# Altium project Ethernet_Module.PrjPcb
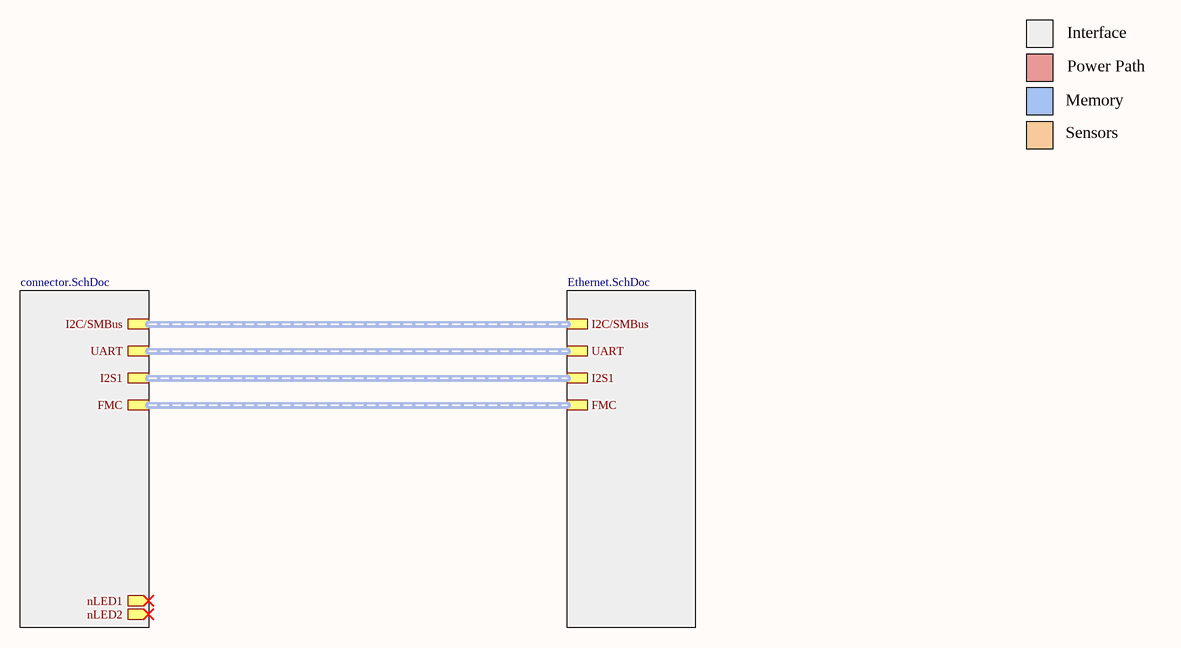
[diagram p0: main.SchDoc]
3 sheets, 39 parts. Net scope: hierarchical (ports join the sheet entries above them; power ports are global).
Board file: Ethernet_Module.PcbDoc
Sheets:
  main.SchDoc
    connector = connector.SchDoc
    peripheral = Ethernet.SchDoc

## Sheet main.SchDoc
size A4; SheetNumber: 1; SheetTotal: 3

### Sub-sheets
connector = connector.SchDoc: UART (harness UART), nLED1 (out), I2C/SMBus (harness I2C/SMBus), I2S1 (harness I2S1), nLED2 (out), FMC (harness FMC)
peripheral = Ethernet.SchDoc: I2C/SMBus, UART, I2S1, FMC

### Buses and harness runs
harness sheet connector/FMC = sheet peripheral/FMC
harness sheet connector/I2C/SMBus = sheet peripheral/I2C/SMBus
harness sheet connector/I2S1 = sheet peripheral/I2S1
harness sheet connector/UART = sheet peripheral/UART

### Notes on the sheet
- Interface
- Power Path
- Memory
- Sensors

## Sheet connector.SchDoc: Ethenet Module
size A3; CompanyName: ETH Zurich, University of Bologna; DrawnBy: Mattia Sinigaglia; Organization: IIS; DocumentNumber: 2; Revision: 0.1; SheetNumber: 3; SheetTotal: 3
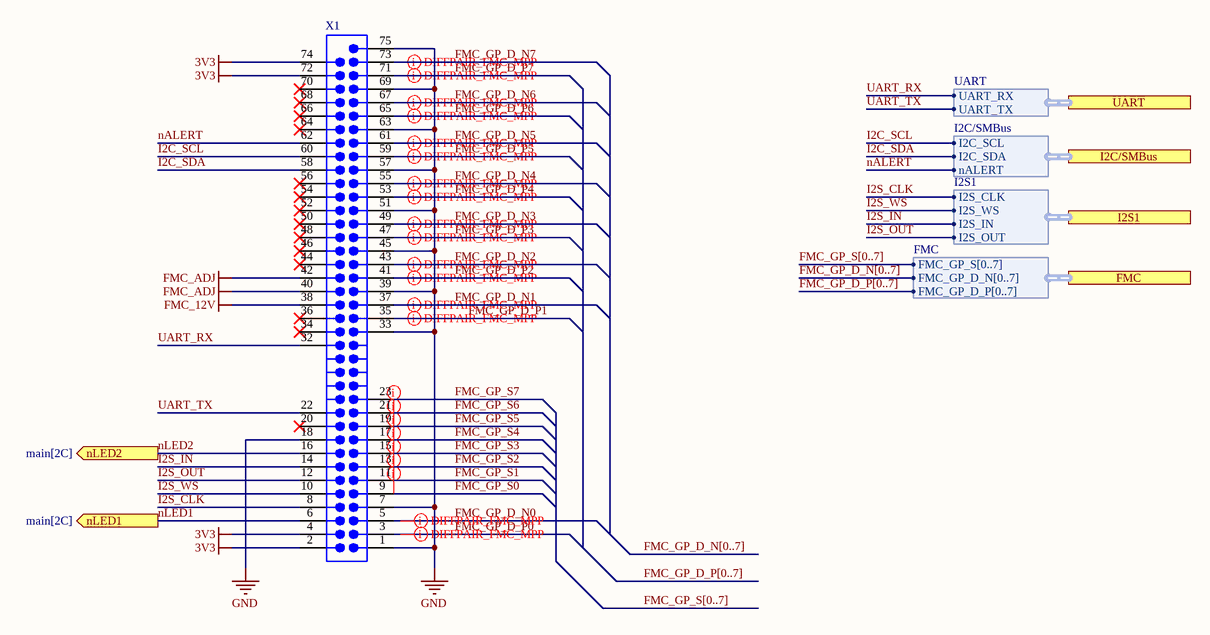
[diagram p1: connector.SchDoc]

### Parts
X1  CONN PWR CARD EDGE PCB SLOT MALE  [CON-67_0.5MM_PCB_SLOT]  (value not drawn)  (no BOM)

### Ports
FMC (harness FMC, see main[2B], Ethernet[2D]), I2C/SMBus (harness I2C/SMBus, see main[2B]), I2S1 (harness I2S1, see main[2B]), nLED1 (out, see main[2C]), nLED2 (out, see main[2C]), UART (harness UART, see main[2B])

### Harnesses
I2C/SMBus: I2C_SDA, I2C_SCL, nALERT
UART: UART_TX, UART_RX
I2S1: I2S_OUT, I2S_IN, I2S_WS, I2S_CLK
FMC: FMC_GP_D_N[0..7], FMC_GP_S[0..7], FMC_GP_D_P[0..7]

### Nets
3V3: X1.2 X1.4 X1.72 X1.74
FMC_12V: X1.38
FMC_ADJ: X1.40 X1.42
GND: X1.1 X1.7 X1.18 X1.33 X1.39 X1.45 X1.51 X1.57 X1.63 X1.69 X1.75
FMC_GP_D_N0: X1.5
FMC_GP_D_N1: X1.37
FMC_GP_D_N2: X1.43
FMC_GP_D_N3: X1.49
FMC_GP_D_N4: X1.55
FMC_GP_D_N5: X1.61
FMC_GP_D_N6: X1.67
FMC_GP_D_N7: X1.73
FMC_GP_D_P0: X1.3
FMC_GP_D_P1: X1.35
FMC_GP_D_P2: X1.41
FMC_GP_D_P3: X1.47
FMC_GP_D_P4: X1.53
FMC_GP_D_P5: X1.59
FMC_GP_D_P6: X1.65
FMC_GP_D_P7: X1.71
FMC_GP_S0: X1.9
FMC_GP_S1: X1.11
FMC_GP_S2: X1.13
FMC_GP_S3: X1.15
FMC_GP_S4: X1.17
FMC_GP_S5: X1.19
FMC_GP_S6: X1.21
FMC_GP_S7: X1.23
I2C_SCL: X1.60 ; port I2C/SMBus.I2C_SCL
I2C_SDA: X1.58 ; port I2C/SMBus.I2C_SDA
I2S_CLK: X1.8 ; port I2S1.I2S_CLK
I2S_IN: X1.14 ; port I2S1.I2S_IN
I2S_OUT: X1.12 ; port I2S1.I2S_OUT
I2S_WS: X1.10 ; port I2S1.I2S_WS
nALERT: X1.62 ; port I2C/SMBus.nALERT
nLED1: X1.6 ; port nLED1
nLED2: X1.16 ; port nLED2
UART_RX: X1.32 ; port UART.UART_RX
UART_TX: X1.22 ; port UART.UART_TX

Not connected (* = marked no-connect by the designer): X1 20* 34* 36* 44* 46* 48* 50* 52(51)* 54(52)* 56(53)* 64* 66* 68* 70*

### Buses and harness runs
bus FMC_GP_D_N[0..7]
bus FMC_GP_D_P[0..7]
bus FMC_GP_S[0..7]

### Layout directives
differential pair; net class DP_GP; differential pair class DP_100R: FMC_GP_D_N0, FMC_GP_D_N1, FMC_GP_D_N2, FMC_GP_D_N3, FMC_GP_D_N4, FMC_GP_D_N5, FMC_GP_D_N6, FMC_GP_D_N7, FMC_GP_D_P0, FMC_GP_D_P1, FMC_GP_D_P2, FMC_GP_D_P3, FMC_GP_D_P4, FMC_GP_D_P5, FMC_GP_D_P6, FMC_GP_D_P7
net class S_GP; net class SE_50R: FMC_GP_S0, FMC_GP_S1, FMC_GP_S2, FMC_GP_S3, FMC_GP_S4, FMC_GP_S5, FMC_GP_S6

### Notes on the sheet
- 1
- 2
- 3
- 4
- 5
- 6
- 7
- 8
- A
- B
- C
- D
- Project:
- Date:
- Drawing number:
- Rev:
- Format:
- A3
- Drawn by:
- Laboratory:
- Page
- Sheet:
- of
- File:

### Library data of the parts
X1 = CMP-01224-1: Mates with 2199119-4 - No BOM; Number of Positions: 67; Pitch: 0.5mm; Card Thickness: 0.8mm; Card Type: Non Specified - Dual Edge; Gender: Male; Mates with: 2199119-4

## Sheet Ethernet.SchDoc: Ethernet Module
size A3; Date: 16/04/2024; Author: Mattia Sinigaglia; CompanyName: ETH Zurich, University of Bologna; DrawnBy: Mattia Sinigaglia; Organization: IIS; DocumentNumber: 1; Revision: 0.1; SheetNumber: 3; SheetTotal: 3; SPICEModelCacheWVXKUZYT: <root> / <DocumentId>WVXKUZYT</DocumentId> / </root>; Project: Ethernet Module
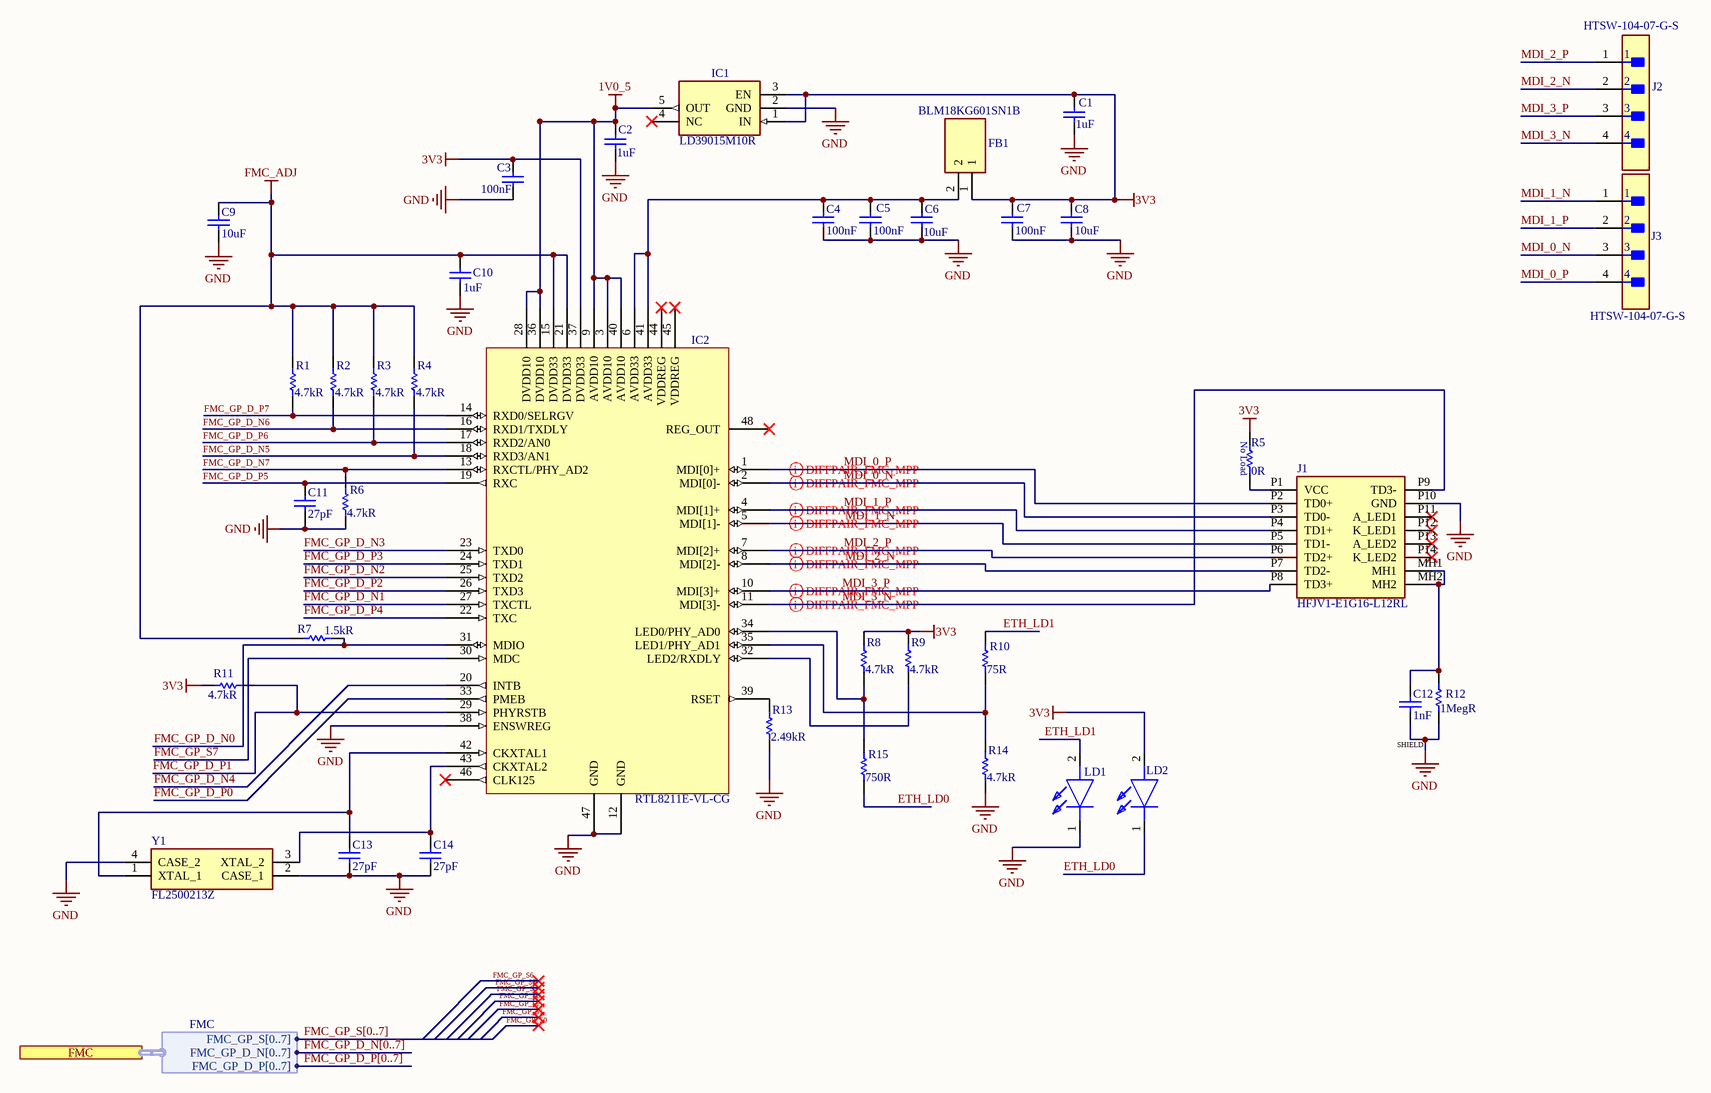
[diagram p2: Ethernet.SchDoc]

### Parts
C1  1uF  [CAPC1005X60X30LL05T10]
C2  1uF  [CAPC1005X60X30LL05T10]
C3  100nF  [CAPC1050X55X23LL05T13]
C4  100nF  [CAPC1050X55X23LL05T13]
C5  100nF  [CAPC1050X55X23LL05T13]
C6  10uF  [CAPC1608X90X35LL15T15]
C7  100nF  [CAPC1050X55X23LL05T13]
C8  10uF  [CAPC1608X90X35LL15T15]
C9  10uF  [CAPC1608X90X35LL15T15]
C10  1uF  [CAPC1005X60X30LL05T10]
C11  27pF  [CAPC1005X56X25LL10T15]
C12  1nF  [CAPC0603(1608)100_L]
C13  27pF  [CAPC1005X56X25LL10T15]
C14  27pF  [CAPC1005X56X25LL10T15]
FB1  BLM18KG601SN1B  [BLM18EG121SH1D]
IC1  LD39015M10R  [SOT95P280X145-5N]
IC2  RTL8211E-VL-CG  [QFN40P600X600X100-49N]
J1  HFJV1-E1G16-L12RL  [HFJV1E1G16L12RL]
J2  HTSW-104-07-G-S  [FP-HTSW-104-07-G-S-MFG]
J3  HTSW-104-07-G-S  [FP-HTSW-104-07-G-S-MFG]
LD1  AA3021LSYSK_J3-TR  [AA3021LSYSKJ3TR]  (value not drawn)
LD2  CSL1901VW1  [LEDC1608X65N]  (value not drawn)
R1  4.7kR  [RESC0603X28X15LL05T05]
R2  4.7kR  [RESC0603X28X15LL05T05]
R3  4.7kR  [RESC0603X28X15LL05T05]
R4  4.7kR  [RESC0603X28X15LL05T05]
R5  0R  [RESC1005X40X25LL05T05]
R6  4.7kR  [RESC0603X28X15LL05T05]
R7  1.5kR  [RESC0603X28N]
R8  4.7kR  [RESC0603X28X15LL05T05]
R9  4.7kR  [RESC0603X28X15LL05T05]
R10  75R  [RESC0603X28X15LL05T05]
R11  4.7kR  [RESC0603X28X15LL05T05]
R12  1MegR  [RESC0603X28X15LL05T05]
R13  2.49kR  [RESC0603X28X15LL05T05]
R14  4.7kR  [RESC0603X28X15LL05T05]
R15  750R  [RESC0603X28X15LL05T05]
Y1  FL2500213Z  [FL2500213Z]

### Ports
FMC (harness FMC, see main[3B], connector[6B])

### Harnesses
FMC: FMC_GP_D_N[0..7], FMC_GP_S[0..7], FMC_GP_D_P[0..7]

### Nets
1V0_5: C2.2 IC1.5(OUT) IC2.3(AVDD10) IC2.9(AVDD10) IC2.28(DVDD10) IC2.36(DVDD10) IC2.40(AVDD10)
3V3: C1.2 C3.2 C7.2 C8.2 FB1.1 IC1.1(IN) IC1.3(EN) IC2.37(DVDD33) LD2.2(A) R5.2 R8.2 R9.2 R11.2
FMC_ADJ: C9.2 C10.2 IC2.15(DVDD33) IC2.21(DVDD33) R1.2 R2.2 R3.2 R4.2 R7.1
GND: C1.1 C2.1 C3.1 C4.1 C5.1 C6.1 C7.1 C8.1 C9.1 C10.1 C11.1 C12.1 C13.1 C14.1 IC1.2(GND) IC2.12(GND) IC2.38(ENSWREG) IC2.47(GND) J1.P10(GND) LD1.1(K) R6.1 R12.1 R13.1 R14.1 Y1.2(CASE_1) Y1.4(CASE_2)
ETH_LD0: LD2.1(K) R15.1
ETH_LD1: LD1.2(A) R10.2
FMC_GP_D_N0: IC2.31(MDIO) R7.2
FMC_GP_D_N1: IC2.27(TXCTL)
FMC_GP_D_N2: IC2.25(TXD2)
FMC_GP_D_N3: IC2.23(TXD0)
FMC_GP_D_N4: IC2.20(INTB)
FMC_GP_D_N5: IC2.18(RXD3/AN1) R4.1
FMC_GP_D_N6: IC2.16(RXD1/TXDLY) R2.1
FMC_GP_D_N7: IC2.13(RXCTL/PHY_AD2) R6.2
FMC_GP_D_P0: IC2.33(PMEB)
FMC_GP_D_P1: IC2.29(PHYRSTB) R11.1
FMC_GP_D_P2: IC2.26(TXD3)
FMC_GP_D_P3: IC2.24(TXD1)
FMC_GP_D_P4: IC2.22(TXC)
FMC_GP_D_P5: C11.2 IC2.19(RXC)
FMC_GP_D_P6: IC2.17(RXD2/AN0) R3.1
FMC_GP_D_P7: IC2.14(RXD0/SELRGV) R1.1
FMC_GP_S7: IC2.30(MDC)
MDI_0_N: IC2.2(MDI[0]-) J1.P3(TD0-) J3.3
MDI_0_P: IC2.1(MDI[0]+) J1.P2(TD0+) J3.4
MDI_1_N: IC2.5(MDI[1]-) J1.P5(TD1-) J3.1
MDI_1_P: IC2.4(MDI[1]+) J1.P4(TD1+) J3.2
MDI_2_N: IC2.8(MDI[2]-) J1.P7(TD2-) J2.2
MDI_2_P: IC2.7(MDI[2]+) J1.P6(TD2+) J2.1
MDI_3_N: IC2.11(MDI[3]-) J1.P9(TD3-) J2.4
MDI_3_P: IC2.10(MDI[3]+) J1.P8(TD3+) J2.3
NetC4_2: C4.2 C5.2 C6.2 FB1.2 IC2.6(AVDD33) IC2.41(AVDD33)
NetC12_2: C12.2 J1.MH1 J1.MH2 R12.2
NetC13_2: C13.2 IC2.42(CKXTAL1) Y1.1(XTAL_1)
NetC14_2: C14.2 IC2.43(CKXTAL2) Y1.3(XTAL_2)
NetIC2_32: IC2.32(LED2/RXDLY) R9.1
NetIC2_34: IC2.34(LED0/PHY_AD0) R8.1 R15.2
NetIC2_35: IC2.35(LED1/PHY_AD1) R10.1 R14.2
NetIC2_39: IC2.39(RSET) R13.2
NetJ1_P1: J1.P1(VCC) R5.1

Not connected (* = marked no-connect by the designer): IC1 4(NC)*; IC2 44(VDDREG)* 45(VDDREG)* 46(CLK125)* 48(REG_OUT)*; J1 P11(A_LED1)* P12(K_LED1)* P13(A_LED2)* P14(K_LED2)*

### Buses and harness runs
bus FMC_GP_D_N[0..7]
bus FMC_GP_D_P[0..7]
bus FMC_GP_S[0..7]

### Layout directives
differential pair; net class DP_GP; differential pair class DP_100R: MDI_0_N, MDI_0_P, MDI_1_N, MDI_1_P, MDI_2_N, MDI_2_P, MDI_3_N, MDI_3_P

### Notes on the sheet
- (near R5) No Load
- SHIELD
- 1
- 2
- 3
- 4
- 5
- 6
- 7
- 8
- A
- B
- C
- D
- Project:
- Date:
- Drawing number:
- Rev:
- Format:
- A3
- Drawn by:
- Laboratory:
- Page
- Sheet:
- of
- File:

### Library data of the parts
C1 C2 C10 = CMP-2008-02044-1: Part Number: C0402C105K9PACTU; Manufacturer: Kemet; Dielectric Material: Ceramic; Tolerance: 10%; Voltage Rating: 6.3V; Dielectric: X5R; Supplier 1: Digi-Key; Supplier Part Number 1: 399-4873-6-ND; Manufacturer Part Number: C0402C105K9PACTU; RoHS: Yes; Category: Ceramic Capacitors; Stock 1: 1737568; Pricing 1: 1=0.10000, 10=0.02600, 100=0.01180, 500=0.00844, 1000=0.00662, 2500=0.00602, 5000=0.00554 (USD); Mount: Surface Mount; Case/Package: 0402; Number of Pins: 2; Case Code (Imperial): 0402; Min Operating Temperature: -55°C; Max Operating Temperature: 85°C; Value: 1uF; Packaging: Tape and Reel; Voltage Rating (DC): 6.3V; Package Quantity: 1; Termination: SMD/SMT; Voltage: 6.3V; Length: 1mm; Height: 0.5mm; Width: 0.02inch; Thickness: 0.022inch; Depth: 0.5mm; Lead Pitch: 0.3mm; Radiation Hardening: No; Lead Free: Lead Free; REACH SVHC: No SVHC; ComponentLink1URL: https://datasheet.ciiva.com/28645/1789732-28645392.pdf?src-supplier=Element14; ComponentLink1Description: https://datasheet.ciiva.com/28645/1789732-28645392.pdf?src-supplier=Element14; ComponentLink2URL: https://datasheet.ciiva.com/11786/0900766b8116eb59-11786028.pdf?src-supplier=RSComponents; ComponentLink2Description: https://datasheet.ciiva.com/11786/0900766b8116eb59-11786028.pdf?src-supplier=RSComponents; ComponentLink3URL: https://datasheet.ciiva.com/7747/kem-c1006-x5r-smd-7747445.pdf?src-supplier=Element14; ComponentLink3Description: https://datasheet.ciiva.com/7747/kem-c1006-x5r-smd-7747445.pdf?src-supplier=Element14; ComponentLink4URL: https://datasheet.ciiva.com/7747/40889-7747623.pdf?src-supplier=Element14; ComponentLink4Description: https://datasheet.ciiva.com/7747/40889-7747623.pdf?src-supplier=Element14; ComponentLink5URL: https://datasheet.ciiva.com/18192/getdatasheetpartid-127800-18192427.pdf?src-supplier=Verical; ComponentLink5Description: https://datasheet.ciiva.com/18192/getdatasheetpartid-127800-18192427.pdf?src-supplier=Verical
C3-C5 C7 = CMP-2000-05439-1: Chip Capacitor, 100 nF, +/- 10%, 16 V, -55 to 125 degC, 0402 (1005 Metric), RoHS, Tape and Reel; Manufacturer: Samsung Electro-Mechanics; Manufacturer Part Number: CL05B104KO5NNNC; Dielectric: X7R; Rated Voltage: 16V; Material: Ceramic; Case Size/Dimension: 0402; Tolerance (%): ±10%; Value: 100nF; Manufacturer URL: http://www.samsungsem.com/global/index.jsp; Datasheet URL: https://datasheet.ciiva.com/29198/458718-da-01-en-vs-kondensator-0402-29198423.pdf; Datasheet Version: Nov-10; Supplier 1: Digi-Key; Supplier Part Number 1: 1276-1001-1-ND; RoHS: Yes; Category: Ceramic Capacitors; Stock 1: 18886859; Pricing 1: 1=0.10000, 10=0.02800, 50=0.01520, 100=0.01240, 500=0.00886, 1000=0.00696, 2500=0.00632, 5000=0.00582 (USD); Mount: Surface Mount; Case/Package: 0402; Case Code (Metric): 1005; Case Code (Imperial): 0402; Contact Plating: Tin; Min Operating Temperature: -55°C; Max Operating Temperature: 125°C; Tolerance: 10%; Packaging: Tape and Reel; Voltage Rating: 16V; Voltage Rating (DC): 16V; Package Quantity: 1; Voltage: 16V; Length: 1mm; Height: 0.5mm; Width: 0.02inch; Depth: 0.5mm; Thickness: 0.022inch; Radiation Hardening: No; Lead Free: Lead Free; ComponentLink1URL: https://datasheet.ciiva.com/26920/getdatasheetpartid-359683-26920169.pdf?src-supplier=Verical; ComponentLink1Description: https://datasheet.ciiva.com/26920/getdatasheetpartid-359683-26920169.pdf?src-supplier=Verical; ComponentLink2URL: https://datasheet.ciiva.com/29198/458718-da-01-en-vs-kondensator-0402-29198423.pdf?src-supplier=Conrad; ComponentLink2Description: https://datasheet.ciiva.com/29198/458718-da-01-en-vs-kondensator-0402-29198423.pdf?src-supplier=Conrad; ComponentLink3URL: https://datasheet.ciiva.com/16208/cl05b104kq5nnnc-16208343.pdf?src-supplier=Future+Electronics; ComponentLink3Description: https://datasheet.ciiva.com/16208/cl05b104kq5nnnc-16208343.pdf?src-supplier=Future+Electronics; ComponentLink4URL: https://datasheet.ciiva.com/26309/mlcc-catalogdownload2013-eng-26309003.pdf?src-supplier=Distrelec; ComponentLink4Description: https://datasheet.ciiva.com/26309/mlcc-catalogdownload2013-eng-26309003.pdf?src-supplier=Distrelec
C6 C8 C9 = CMP-2006-04476-1: Manufacturer: AVX Interconnect / Elco; Part Number: 06036D106MAT2A; Dielectric Material: Ceramic; Tolerance: 20%; Voltage Rating: 6.3V; Dielectric: X5R; Supplier 1: Digi-Key; Supplier Part Number 1: 478-5318-1-ND; Manufacturer Part Number: 06036D106MAT2A; RoHS: Yes; Category: Ceramic Capacitors; Stock 1: 1934840; Pricing 1: 1=0.24000, 10=0.16500, 50=0.09900, 100=0.08360, 500=0.05720, 1000=0.05060 (USD); Mount: Surface Mount,PCB; Case/Package: 0603; Number of Pins: 2; Case Code (Metric): 1608; Case Code (Imperial): 0603; Contact Plating: Tin,Matte; Min Operating Temperature: -55°C; Max Operating Temperature: 85°C; Value: 10uF; Packaging: Tape and Reel; Package Quantity: 1; Voltage Rating (DC): 6.3V; Termination: SMD/SMT; Series: -; Construction: Flat; Voltage: 6.3V; Length: 1.6mm; Width: 0.032inch; Height: 0.9mm; Thickness: 0.035inch; Depth: 0.81mm; Radiation Hardening: No; RoHS Compliant: Yes; Lead Free: Lead Free; REACH SVHC: No SVHC; ComponentLink1URL: https://datasheet.ciiva.com/153/cx5r-153301.pdf?src-supplier=Digi-Key; ComponentLink1Description: https://datasheet.ciiva.com/153/cx5r-153301.pdf?src-supplier=Digi-Key; ComponentLink2URL: https://datasheet.ciiva.com/1458/1796776-1458117.pdf?src-supplier=Element14; ComponentLink2Description: https://datasheet.ciiva.com/1458/1796776-1458117.pdf?src-supplier=Element14; ComponentLink3URL: https://datasheet.ciiva.com/153/cx5r-153302.pdf?src-supplier=Digi-Key; ComponentLink3Description: https://datasheet.ciiva.com/153/cx5r-153302.pdf?src-supplier=Digi-Key; ComponentLink4URL: https://datasheet.ciiva.com/153/cx5r-153303.pdf?src-supplier=Digi-Key; ComponentLink4Description: https://datasheet.ciiva.com/153/cx5r-153303.pdf?src-supplier=Digi-Key; ComponentLink5URL: https://datasheet.ciiva.com/5422/cx5r-33896-5422935.pdf?src-supplier=Mouser; ComponentLink5Description: https://datasheet.ciiva.com/5422/cx5r-33896-5422935.pdf?src-supplier=Mouser; ComponentLink6URL: https://datasheet.ciiva.com/16538/cx5r-16538025.pdf?src-supplier=Avnet+Asia; ComponentLink6Description: https://datasheet.ciiva.com/16538/cx5r-16538025.pdf?src-supplier=Avnet+Asia; ComponentLink7URL: https://datasheet.ciiva.com/2987/cx5r-2987866.pdf?src-supplier=Avnet; ComponentLink7Description: https://datasheet.ciiva.com/2987/cx5r-2987866.pdf?src-supplier=Avnet; ComponentLink8URL: https://datasheet.ciiva.com/14591/70001028-14591754.pdf?src-supplier=Allied+Electronics; ComponentLink8Description: https://datasheet.ciiva.com/14591/70001028-14591754.pdf?src-supplier=Allied+Electronics; ComponentLink9URL: https://datasheet.ciiva.com/2987/cx5r-2987867.pdf?src-supplier=Avnet; ComponentLink9Description: https://datasheet.ciiva.com/2987/cx5r-2987867.pdf?src-supplier=Avnet; ComponentLink10URL: https://datasheet.ciiva.com/16201/cx5r-16201627.pdf?src-supplier=Future+Electronics; ComponentLink10Description: https://datasheet.ciiva.com/16201/cx5r-16201627.pdf?src-supplier=Future+Electronics
C11 C13 C14 = CMP-2008-02772-1: 0402YA270JAT2A; Manufacturer: AVX Interconnect / Elco; Part Number: 0402YA270JAT2A
C12 = CMP-1035-01871-1: CAP 1nF 10V ±1% 0603 (1608 Metric) Thickness 1mm SMD; Tolerance: Â±1%; Case-Metric: 1608; Case-EIA: 0603; Technology: SMT; Rated Voltage: 10 V; Value: 1nF; Max Thickness: 1 mm
FB1 = BLM18KG601SN1B: Ferrite Bead; Manufacturer_Name: Murata Electronics; Datasheet Link: http://www.murata.com/~/media/webrenewal/support/library/catalog/products/emc/emifil/c31e.ashx?la=en-gb; Height: 0.95mm; Manufacturer_Part_Number: BLM18KG601SN1B
IC1 = LD39015M10R: Integrated Circuit; Manufacturer_Name: STMicroelectronics; Datasheet Link: http://www.st.com/web/en/resource/technical/document/datasheet/CD00173477.pdf; Height: 1.45mm; Manufacturer_Part_Number: LD39015M10R; Mouser Part Number: 511-LD39015M10R; Mouser Price/Stock: https://www.mouser.co.uk/ProductDetail/STMicroelectronics/LD39015M10R?qs=wsLAKTqgg6iLO1LS4XmvbQ%3D%3D; Arrow Part Number: LD39015M10R; Arrow Price/Stock: https://www.arrow.com/en/products/ld39015m10r/stmicroelectronics
IC2 = RTL8211E-VL-CG: GbE PHY with RGMII interface & EEE feature, 1.8V & 1.5V; Manufacturer: Realtek; Supplier: Win Source Electronics; Supplier Part Number: 758353-RTL8211E-VL-CG; Manufacturer Part Number: RTL8211E-VL-CG; RoHS: Yes; Stock: 54900; Pricing: 98=3,06900 (USD); RoHS Compliant: Yes
J1 = HFJV1-E1G16-L12RL: Connector; Manufacturer_Name: Halo Electronics; Datasheet Link: https://componentsearchengine.com/Datasheets/1/HFJV1-E1G16-L12RL.pdf; Height: 16.51mm; Manufacturer_Part_Number: HFJV1-E1G16-L12RL; Mouser Part Number: 493-HFJV1-E1G16L12RL; Mouser Price/Stock: https://www.mouser.co.uk/ProductDetail/HALO-Electronics/HFJV1-E1G16-L12RL?qs=cGEy3R83DS%2FPhGzGdiRY4A%3D%3D
J2 J3 = CMP-02766-001776-1: CONN HEADER VERT 4POS 2.54MM; Gender: Male; Number of Contacts: 4; Packaging: Bulk; RoHS Compliant: Yes; Number of Rows: 1; Mount: Through Hole; Contact Material: Bronze; Series: HTSW; Radiation Hardening: No; Pitch: 2.54mm; Reach SVHC Compliant: Yes; Contact Plating: Gold; Termination: Through Hole
LD1 = AA3021LSYSK_J3-TR: LED; Manufacturer_Name: Kingbright; Manufacturer_Part_Number: AA3021LSYSK/J3-TR; Datasheet Link: https://eagle.componentsearchengine.com/Datasheets/1/AA3021LSYSK_J3-TR.pdf; Height: 1.3mm; Mouser Part Number: 604-AA3021LSYSK/J3TR; Mouser Price/Stock: https://www.mouser.co.uk/ProductDetail/Kingbright/AA3021LSYSK-J3-TR?qs=Oo40KB9lBTmS1V8p5PSO3Q%3D%3D
LD2 = CSL1901VW1: LED; Manufacturer_Name: ROHM Semiconductor; Datasheet Link: https://fscdn.rohm.com/en/products/databook/datasheet/opto/led/chip_mono/csl1901vw1-e.pdf; Height: 0.65mm; Manufacturer_Part_Number: CSL1901VW1; Mouser Part Number: 755-CSL1901VW1; Mouser Price/Stock: https://www.mouser.co.uk/ProductDetail/ROHM-Semiconductor/CSL1901VW1?qs=vvQtp7zwQdNmrXZcE27xEA%3D%3D
R1-R4 R6 R8-R11 R14 R15 = CMP-2004-00671-1: CRCW02014K70FKED; Manufacturer: Vishay Dale; Part Number: CRCW02014K70FKED
R5 = CMP-2000-07451-1: ERJ2GE0R00X Chip Resistor, 0 Ohm, 0.1 W, -55 to 155 degC, 0402 (1005 Metric), RoHS, Tape and Reel; Manufacturer: Panasonic; Voltage Rating (DC): 50V; Temperature Coefficient: 600ppm/��C; Max Power Dissipation: 100mW; Resistance: 0mOhm; Tolerance: 5%; Number of Terminations: 2; Mount: SurfaceMount; Height: 0.35mm; Packaging: TapeandReel; Contact Plating: Tin; Manufacturer URL: http://www.panasonic.com/; Composition: ThickFilm; Max Operating Temperature: 155degC; REACH SVHC: NoSVHC; Case/Package: 0402; Package Reference: 402; Depth: 0.5mm; Package Description: 2-Pin Surface Mount Device, Body 1 x 0.5 mm; Datasheet URL: https://industrial.panasonic.com/cdbs/www-data/pdf/RDA0000/AOA0000C301.pdf; RoHSCompliant: True; Case Code (Imperial): 0402; Military Standard: Not; Min Operating Temperature: -55degC; Power Rating: 100mW; Datasheet Version: 03/2015; Length: 1mm; Case Code (Metric): 1005; Termination: SMD/SMT; Mounting Technology: SurfaceMount; Voltage Rating: 50V; Width: 0.02inch; Package Quantity: 1; Lead Free: LeadFree; Radiation Hardening: No
R7 = CRCW02011K50FKED: Manufacturer_Name: Vishay; Datasheet Link: http://www.vishay.com/docs/20035/dcrcwe3.pdf; Height: 0.28mm; Manufacturer_Part_Number: CRCW02011K50FKED; Mouser Part Number: 71-CRCW02011K50FKED; Mouser Price/Stock: https://www.mouser.com/Search/Refine.aspx?Keyword=71-CRCW02011K50FKED; Arrow Part Number: CRCW02011K50FKED; Arrow Price/Stock: https://www.arrow.com/en/products/crcw02011k50fked/vishay
R12 = CMP-2004-00671-1: CRCW02011M00FKED; Manufacturer: Vishay Dale; Part Number: CRCW02014K70FKED
R13 = CMP-2004-00671-1: CRCW02012K49FKED; Manufacturer: Vishay Dale; Part Number: CRCW02014K70FKED
Y1 = FL2500213Z: Crystal or Oscillator; Manufacturer_Name: Diodes Inc.; Datasheet Link: https://www.diodes.com/assets/Datasheets/FL.pdf; Height: 0.78mm; Manufacturer_Part_Number: FL2500213Z; Mouser Part Number: 729-FL2500213Z; Mouser Price/Stock: https://www.mouser.co.uk/ProductDetail/Diodes-Incorporated/FL2500213Z?qs=Rp3RbKSfAt0a9%2FPmeza8Xg%3D%3D; Arrow Part Number: FL2500213Z; Arrow Price/Stock: https://www.arrow.com/en/products/fl2500213z/diodes-incorporated?region=nac

## Nets that join several sheets
3V3: connector (X1.2 X1.4 X1.72 X1.74), Ethernet (13 pins)
FMC_ADJ: connector (X1.40 X1.42), Ethernet (9 pins)
GND: connector (11 pins), Ethernet (26 pins)
FMC_GP_D_N0: connector (X1.5), Ethernet (IC2.31 R7.2)
FMC_GP_D_N1: connector (X1.37), Ethernet (IC2.27)
FMC_GP_D_N2: connector (X1.43), Ethernet (IC2.25)
FMC_GP_D_N3: connector (X1.49), Ethernet (IC2.23)
FMC_GP_D_N4: connector (X1.55), Ethernet (IC2.20)
FMC_GP_D_N5: connector (X1.61), Ethernet (IC2.18 R4.1)
FMC_GP_D_N6: connector (X1.67), Ethernet (IC2.16 R2.1)
FMC_GP_D_N7: connector (X1.73), Ethernet (IC2.13 R6.2)
FMC_GP_D_P0: connector (X1.3), Ethernet (IC2.33)
FMC_GP_D_P1: connector (X1.35), Ethernet (IC2.29 R11.1)
FMC_GP_D_P2: connector (X1.41), Ethernet (IC2.26)
FMC_GP_D_P3: connector (X1.47), Ethernet (IC2.24)
FMC_GP_D_P4: connector (X1.53), Ethernet (IC2.22)
FMC_GP_D_P5: connector (X1.59), Ethernet (C11.2 IC2.19)
FMC_GP_D_P6: connector (X1.65), Ethernet (IC2.17 R3.1)
FMC_GP_D_P7: connector (X1.71), Ethernet (IC2.14 R1.1)
FMC_GP_S7: connector (X1.23), Ethernet (IC2.30)